# Altium schematic sheet Sheet1.SchDoc: FLOAT BOARD 2024
size B; DrawnBy: TOBY C.; Engineer: TOBY C.; Organization: CWRUBOTIX; Revision: 0; SheetNumber: 1; SheetTotal: 1; ENG_APP_DATE: --/--/--; DSN_APP_DATE: --/--/--; CHK_APP_DATE: --/--/--
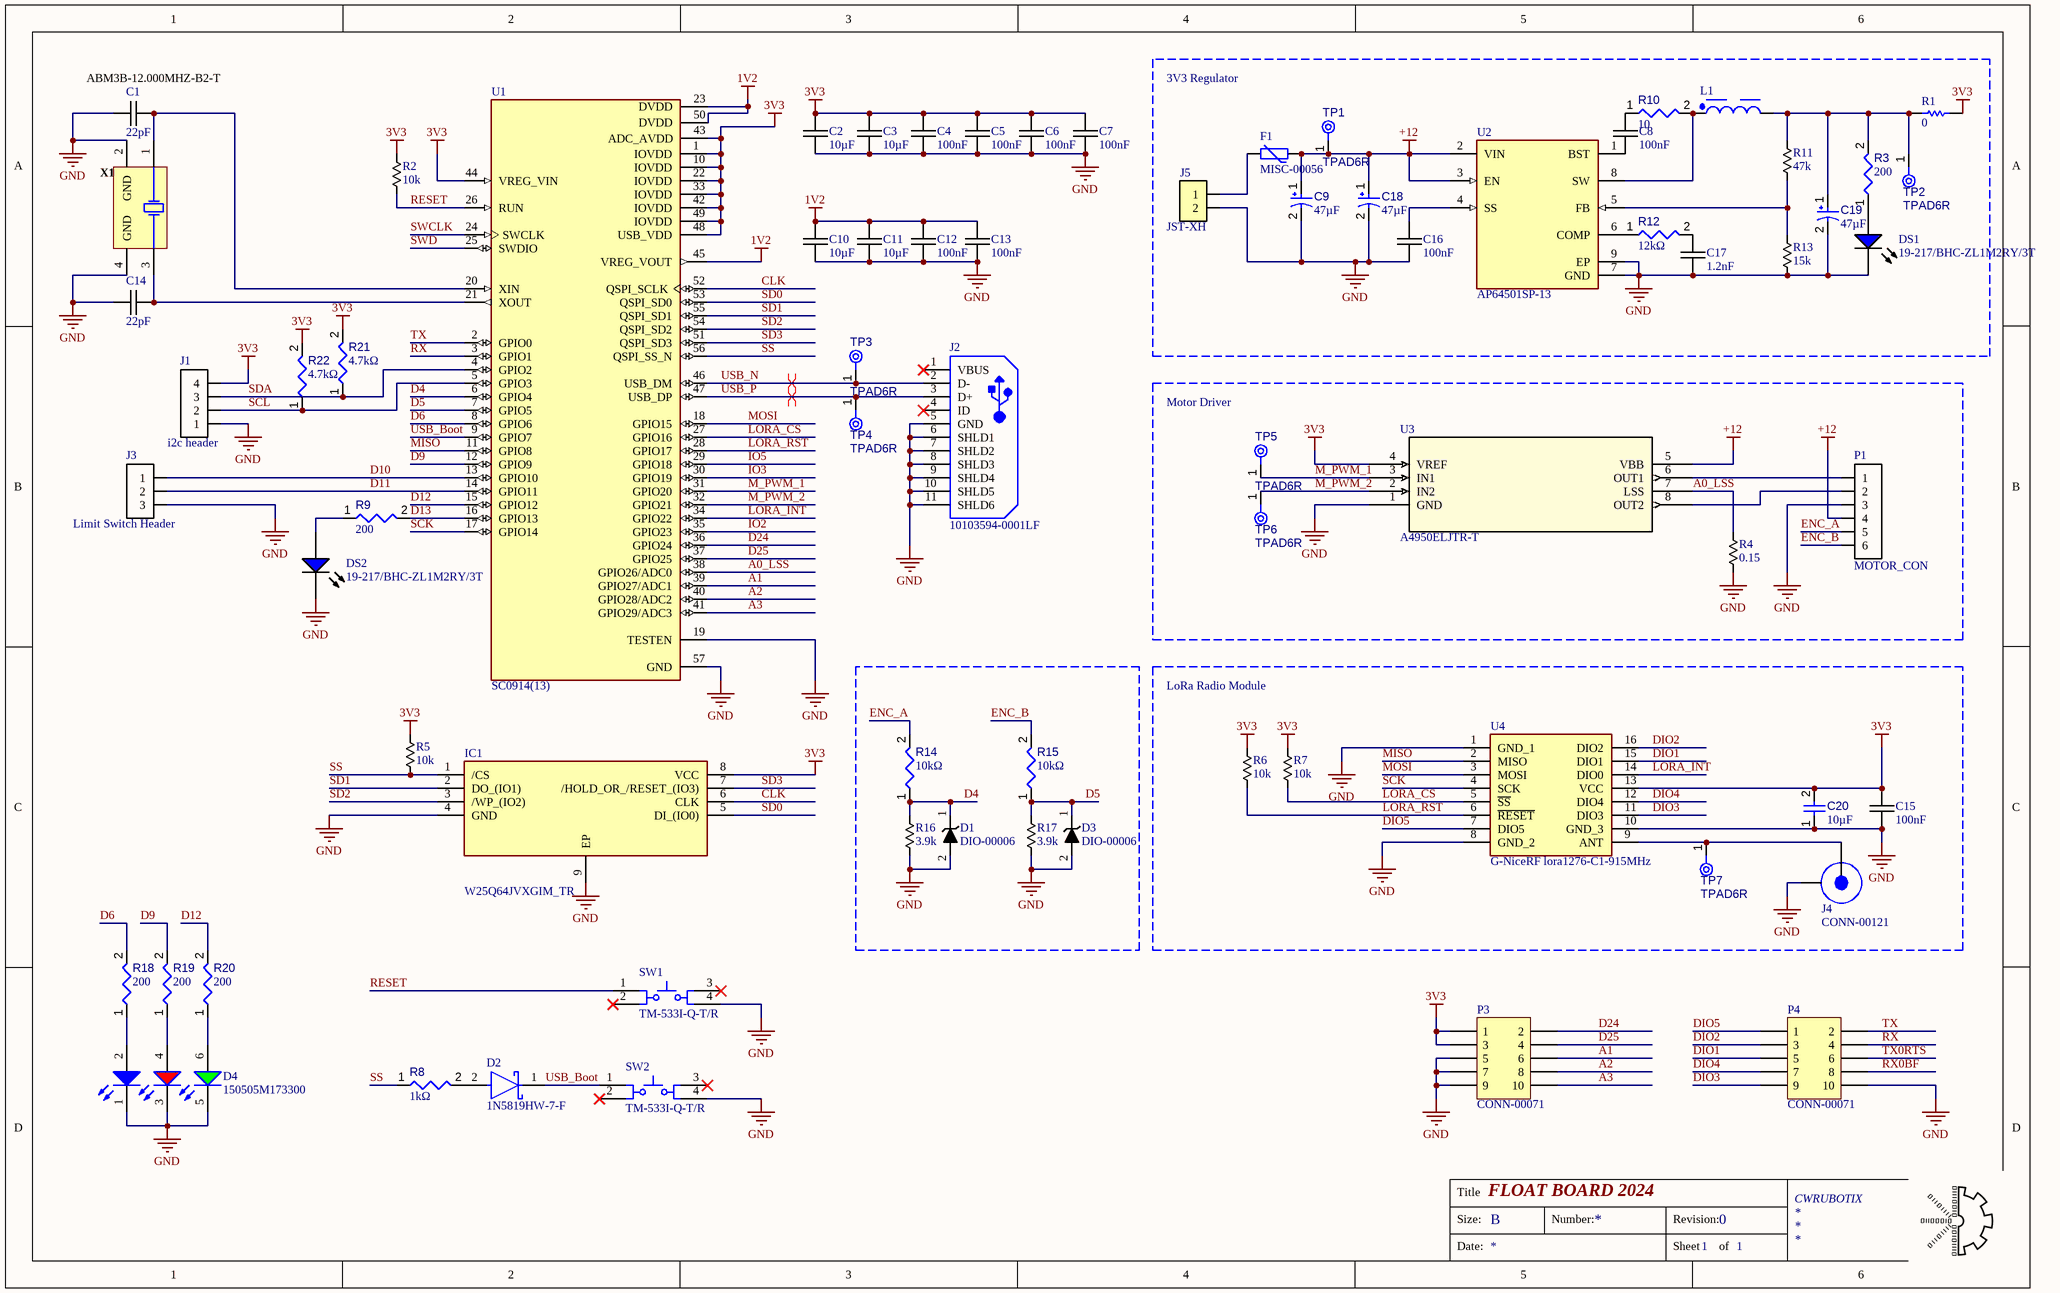
[diagram p0: Sheet1.SchDoc]

## Parts
C1  value 22pF  [chip_0603]  (hidden comment: CAP-00408)
C2  value 10µF  [chip_0805]  (hidden comment: CAP-00135)
C3  value 10µF  [chip_0805]  (hidden comment: CAP-00135)
C4  value 100nF  [chip_0603]  (hidden comment: CAP-00542)
C5  value 100nF  [chip_0603]  (hidden comment: CAP-00542)
C6  value 100nF  [chip_0603]  (hidden comment: CAP-00542)
C7  value 100nF  [chip_0603]  (hidden comment: CAP-00542)
C8  value 100nF  [chip_0603]  (hidden comment: CAP-00542)
C9  value 47µF  [AVX-TAJ-C-2_L]  (hidden comment: TAJC476K016RNJ)
C10  value 10µF  [chip_0805]  (hidden comment: CAP-00135)
C11  value 10µF  [chip_0805]  (hidden comment: CAP-00135)
C12  value 100nF  [chip_0603]  (hidden comment: CAP-00542)
C13  value 100nF  [chip_0603]  (hidden comment: CAP-00542)
C14  value 22pF  [chip_0603]  (hidden comment: CAP-00408)
C15  value 100nF  [chip_0603]  (hidden comment: CAP-00542)
C16  value 100nF  [chip_0603]  (hidden comment: CAP-00542)
C17  value 1.2nF  [chip_0603]  (hidden comment: CAP-00470)
C18  value 47µF  [AVX-TAJ-C-2_L]  (hidden comment: TAJC476K016RNJ)
C19  value 47µF  [AVX-TAJ-C-2_L]  (hidden comment: TAJC476K016RNJ)
C20  value 10µF  [CAPC0603(1608)100_L]  (hidden comment: Capacitor 10µF +/-20% 10V 0603)
D1  DIO-00006  [sod323_0]
D2  1N5819HW-7-F  [FP-SOD123-IPC_B]
D3  DIO-00006  [sod323_0]
D4  150505M173300  [WL-SFTW_5050_150505M173300]
DS1  19-217/BHC-ZL1M2RY/3T  [EVRL-0603-2_V]
DS2  19-217/BHC-ZL1M2RY/3T  [EVRL-0603-2_V]
F1  MISC-00056  [chip_1210]
IC1  W25Q64JVXGIM_TR  [SON80P400X400X50-9N]
J1  i2c header  [JST_XH_4_0]
J2  10103594-0001LF  [FCI-10103594-0001LF_V]
J3  Limit Switch Header  [JST_XH_3_0]
J4  CONN-00121  [SAMTEC_SMA-J-P-H-ST-EM1]
J5  JST-XH  [HDDR_2x1_0]
L1  7440430012  [WE-TPC_4828]  (value not drawn)
P1  MOTOR_CON  [HDDR_6X1_0]
P3  CONN-00071  [SAMTEC_SMD_HDDR_5x2]
P4  CONN-00071  [SAMTEC_SMD_HDDR_5x2]
R1  value 0  [RESC1608X55X25ML10T15]  (hidden comment: Resistor 0R +/- 5% 0603 100 mW)
R2  value 10k  [chip_0603]  (hidden comment: RES-00306)
R3  value 200  [RESC0402(1005)_L]  (hidden comment: Resistor 200R +/-5 % 0402 63 mW)
R4  value 0.15  [chip_0603]  (hidden comment: RES-00074)
R5  value 10k  [chip_0603]  (hidden comment: RES-00306)
R6  value 10k  [chip_0603]  (hidden comment: RES-00306)
R7  value 10k  [chip_0603]  (hidden comment: RES-00306)
R8  value 1kΩ  [RESC0402(1005)_L]  (hidden comment: 1KR2J)
R9  value 200  [RESC0402(1005)_L]  (hidden comment: Resistor 200R +/-5 % 0402 63 mW)
R10  value 10  [RESC0402(1005)_L]  (hidden comment: Resistor 10R  +/-1 % 0402 63 mW)
R11  value 47k  [chip_0603]  (hidden comment: RES-00799)
R12  value 12kΩ  [RESC0402(1005)_L]  (hidden comment: 12KR2F)
R13  value 15k  [chip_0603]  (hidden comment: RES-00341)
R14  value 10kΩ  [RESC0402(1005)_L]  (hidden comment: 10KR2F)
R15  value 10kΩ  [RESC0402(1005)_L]  (hidden comment: 10KR2F)
R16  value 3.9k  [chip_0603]  (hidden comment: RES-00782)
R17  value 3.9k  [chip_0603]  (hidden comment: RES-00782)
R18  value 200  [RESC0402(1005)_L]  (hidden comment: Resistor 200R +/-5 % 0402 63 mW)
R19  value 200  [RESC0402(1005)_L]  (hidden comment: Resistor 200R +/-5 % 0402 63 mW)
R20  value 200  [RESC0402(1005)_L]  (hidden comment: Resistor 200R +/-5 % 0402 63 mW)
R21  value 4.7kΩ  [RESC0402(1005)_L]  (hidden comment: 4D7KR2F)
R22  value 4.7kΩ  [RESC0402(1005)_L]  (hidden comment: 4D7KR2F)
SW1  TM-533I-Q-T/R  [MULT-TM-533I-Q_V]
SW2  TM-533I-Q-T/R  [MULT-TM-533I-Q_V]
TP1  TPAD6R  [TP06R]  (no BOM)
TP2  TPAD6R  [TP06R]  (no BOM)
TP3  TPAD6R  [TP06R]  (no BOM)
TP4  TPAD6R  [TP06R]  (no BOM)
TP5  TPAD6R  [TP06R]  (no BOM)
TP6  TPAD6R  [TP06R]  (no BOM)
TP7  TPAD6R  [TP06R]  (no BOM)
U1  SC0914(13)  [QFN40P700X700X90-57N]
U2  AP64501SP-13  [FP-SO-8EP-IPC_B]
U3  A4950ELJTR-T  [DDA0008H_L]
U4  G-NiceRF lora1276-C1-915MHz  [New footprint 1]
X1  ABM3B-12.000MHZ-B2-T  [ABRA-ABM3B-4_V]

## Blocks framed on the sheet
3V3 Regulator: C8 C9 C16-C19 DS1 F1 J5 L1 R1 R3 R10-R13 TP1 TP2 U2
Motor Driver: P1 R4 TP5 TP6 U3
LoRa Radio Module: C15 C20 J4 R6 R7 TP7 U4

## Nets
1V2: C10.1 C11.1 C12.1 C13.1 U1.23(DVDD) U1.45(VREG_VOUT) U1.50(DVDD)
3V3: C2.1 C3.1 C4.1 C5.1 C6.1 C7.1 C15.1 C20.2 IC1.8(VCC) J1.4 P3.1 P3.3 R1.2 R2.1 R5.1 R6.1 R7.1 R21.2 R22.2 U1.1(IOVDD) U1.10(IOVDD) U1.22(IOVDD) U1.33(IOVDD) U1.42(IOVDD) U1.43(ADC_AVDD) U1.44(VREG_VIN) U1.48(USB_VDD) U1.49(IOVDD) U3.4(VREF) U4.13(VCC)
+12: C9.1 C18.1 F1.1 P1.4 TP1.1(TP) U2.2(VIN) U2.3(EN) U3.5(VBB)
GND: C1.2 C2.2 C3.2 C4.2 C5.2 C6.2 C7.2 C9.2 C10.2 C11.2 C12.2 C13.2 C14.1 C15.2 C16.2 C17.2 C18.2 C19.2 C20.1 D1.2 D3.2 D4.1(K) D4.3(K) D4.5(K) DS1.2(K) DS2.2(K) IC1.4(GND) IC1.9(EP) J1.1 J2.5(GND) J2.6(SHLD1) J2.7(SHLD2) J2.8(SHLD3) J2.9(SHLD4) J2.10(SHLD5) J2.11(SHLD6) J3.3 J4.2 J5.2 P1.3 P3.5 P3.7 P3.9 P4.10 R4.2 R13.2 R16.2 R17.2 SW1.4 SW2.4 U1.19(TESTEN) U1.57(GND) U2.7(GND) U2.9(EP) U3.1(GND) U4.1(GND_1) U4.8(GND_2) U4.10(GND_3) X1.2(GND) X1.4(GND)
A0_LSS: R4.1 U1.38(GPIO26/ADC0) U3.7(LSS)
A1: P3.6 U1.39(GPIO27/ADC1)
A2: P3.8 U1.40(GPIO28/ADC2)
A3: P3.10 U1.41(GPIO29/ADC3)
CLK: IC1.6(CLK) U1.52(QSPI_SCLK)
D4: D1.1 R14.1 R16.1 U1.6(GPIO4)
D5: D3.1 R15.1 R17.1 U1.7(GPIO5)
D6: R18.2 U1.8(GPIO6)
D9: R19.2 U1.12(GPIO9)
D10: J3.1 U1.13(GPIO10)
D11: J3.2 U1.14(GPIO11)
D12: R20.2 U1.15(GPIO12)
D13: R9.2 U1.16(GPIO13)
D24: P3.2 U1.36(GPIO24)
D25: P3.4 U1.37(GPIO25)
DIO1: P4.5 U4.15(DIO1)
DIO2: P4.3 U4.16(DIO2)
DIO3: P4.9 U4.11(DIO3)
DIO4: P4.7 U4.12(DIO4)
DIO5: P4.1 U4.7(DIO5)
ENC_A: P1.5 R14.2
ENC_B: P1.6 R15.2
IO2: U1.35(GPIO23)
IO3: U1.30(GPIO19)
IO5: U1.29(GPIO18)
LORA_CS: R7.2 U1.27(GPIO16) U4.5(~{SS})
LORA_INT: U1.34(GPIO22) U4.14(DIO0)
LORA_RST: R6.2 U1.28(GPIO17) U4.6(~{RESET})
M_PWM_1: TP5.1(TP) U1.31(GPIO20) U3.3(IN1)
M_PWM_2: TP6.1(TP) U1.32(GPIO21) U3.2(IN2)
MISO: U1.11(GPIO8) U4.2(MISO)
MOSI: U1.18(GPIO15) U4.3(MOSI)
RESET: R2.2 SW1.1 U1.26(RUN)
RX: P4.4 U1.3(GPIO1)
RX0BF: P4.8
SCK: U1.17(GPIO14) U4.4(SCK)
SCL: J1.2 R22.1 U1.5(GPIO3)
SD0: IC1.5(DI_(IO0)) U1.53(QSPI_SD0)
SD1: IC1.2(DO_(IO1)) U1.55(QSPI_SD1)
SD2: IC1.3(/WP_(IO2)) U1.54(QSPI_SD2)
SD3: IC1.7(/HOLD_OR_/RESET_(IO3)) U1.51(QSPI_SD3)
SDA: J1.3 R21.1 U1.4(GPIO2)
SS: IC1.1(/CS) R5.2 R8.1 U1.56(QSPI_SS_N)
SWCLK: U1.24(SWCLK)
SWD: U1.25(SWDIO)
TX: P4.2 U1.2(GPIO0)
TX0RTS: P4.6
USB_Boot: D2.1(C) SW2.1 U1.9(GPIO7)
USB_N: J2.2(D-) TP3.1(TP) U1.46(USB_DM)
USB_P: J2.3(D+) TP4.1(TP) U1.47(USB_DP)
NetC1_1: C1.1 U1.20(XIN) X1.1(X1)
NetC8_1: C8.1 R10.1
NetC8_2: C8.2 U2.1(BST)
NetC14_2: C14.2 U1.21(XOUT) X1.3(X2)
NetC16_1: C16.1 U2.4(SS)
NetC17_1: C17.1 R12.2
NetC19_1: C19.1 L1.2 R1.1 R3.2 R11.1 TP2.1(TP)
NetD2_2: D2.2(A) R8.2
NetD4_2: D4.2(A) R18.1
NetD4_4: D4.4(A) R19.1
NetD4_6: D4.6(A) R20.1
NetDS1_1: DS1.1(A) R3.1
NetDS2_1: DS2.1(A) R9.1
NetF1_2: F1.2 J5.1
NetJ4_1: J4.1 TP7.1(TP) U4.9(ANT)
NetL1_1: L1.1 R10.2 U2.8(SW)
NetP1_1: P1.1 U3.6(OUT1)
NetP1_2: P1.2 U3.8(OUT2)
NetR11_2: R11.2 R13.1 U2.5(FB)
NetR12_1: R12.1 U2.6(COMP)

Not connected (* = marked no-connect by the designer): J2 1(VBUS)* 4(ID)*; SW1 2* 3*; SW2 2* 3*

## Layout directives
differential pair: USB_N, USB_P

## Notes on the sheet
- Title
- Size:
- B
- Number:
- Revision:
- Date:
- Sheet
- of

## Library data of the parts
C1 C14 = CMP-001-00458-1: CAP, 22pF, ±2%, 50V, C0G, 0603; Manufacturer: Murata; Manufacturer PN: GRM1885C1H220GA01D; Type: C0G; Tolerance: 2%; Part Number: CAP-00408; Voltage Rating: 50V
C2 C3 C10 C11 = CMP-001-00218-1: CAP, 10uF, 10%, 6.3V, X7R, 0805; Manufacturer: Murata; Manufacturer PN: GRM21BR70J106KE76K; Type: X7R; Part Number: CAP-00135; Voltage Rating: 6.3V; Tolerance: 10%
C4-C8 C12 C13 C15 C16 = CMP-001-00592-1: CAP, 0.1uF, ±10%, 16V, X7R, 0603; Manufacturer: Murata; Voltage Rating: 16V; Tolerance: 10%; Part Number: CAP-00542; Type: X7R
C9 C18 C19 = CMP-001-00047-6: Standard Tantalum, 47 uF, +/- 10%, 16 V, -55 to 125 degC, 2312 (6032 Metric), RoHS, Tape and Reel; Manufacturer: AVX; Resistance: 0.5Ohm; Voltage Rating: 16V; ESR: 500mohm; Tolerance: 10%; Case/Package: 2312; Capacitor Type: Tantalum; Datasheet URL: http://datasheets.avx.com/TAJ.pdf; Packaging: TapeandReel; Max Operating Temperature: 125°C; Manufacturer URL: http://www.avx.com/; Pins: 2; Package Quantity: 500; Datasheet Version: Feb-16; Min Operating Temperature: -55°C; Package Description: 2-Pin Surface Mount Device, Body 6 x 3.25 mm; Mounting Technology: SM; Package Reference: TAJ-C-2; RoHS Compliant: True
C17 = CMP-001-00520-1: CAP, 1200pF, ±1%, 50V, C0G, 0603; Manufacturer PN: GRM1885C1H122FA01D; Manufacturer: Murata; Tolerance: 1%; Part Number: CAP-00470; Type: C0G; Voltage Rating: 50V
C20 = CMP-001-00075-3: Chip Capacitor, 10µF +/-20%, 10V, 0603, Thickness 1 mm; Tolerance: 10%; Voltage Rating: 10V; Mounting Technology: SMT; Max Operating Temperature: 85°C; Min Operating Temperature: -55°C; Pins: 2; Case/Package: 0603
D1 D3 = CMP-004-00037-1: Dio Zen, 3.9V, 2%, 300mW, SOD-323; Manufacturer PN: MM3Z3V9ST1G; Manufacturer: ON Semi; Type: Zener; Forward Voltage: 900mV; Part Number: DIO-00006; Power Rating: 300mW; Reverse Breakdown Voltage: 3.9V; Tolerance: 2%
D2 = CMP-004-00132-1: Rectifier Diode, Schottky, 1 Phase, 1 Element, 1A, 40V V(RRM), Silicon; Forward Voltage: 320mV; Min Operating Temperature: -65°C; Max Operating Temperature: 125°C; RoHS Compliant: Yes; Pins: 2
D4 = CMP-03913-90235585-1: 150505M173300 WL-SFTW SMT full-color TOP LED waterclear; Max Reverse Voltage (DC): 5V; Forward Current: 80mA; Max Junction Temperature (Tj): 115°C; Peak Wavelength: 465nm; Color: Blue, Green, Red; Viewing Angle: 120°; Luminous Intensity: 350mcd; Dominant Wavelength: 520nm; Forward Voltage: 2V; Power Dissipation: 72mW; Length: 5.4mm; Width: 5mm; Min Operating Temperature: -40°C; Height: 1.5mm; Packaging: Tape and Reel; Max Operating Temperature: 85°C; RoHS: Compliant; Reverse Voltage: 5V; NexarPartId: 90235585
DS1 DS2 = CMP-007-00003-1: Chip LED, Blue, 5 V, 25 mA, -40 to 85 degC, 2-Pin SMD (0603), RoHS, Tape and Reel; Manufacturer: Everlight Electronics; Luminous Intensity: 28.5mcd; Forward Voltage: 3V; Forward Current: 25mA; Viewing Angle: 120degrees; Lens Style: Diffused; Packaging: TapeandReel; Mounting Technology: SM; Manufacturer URL: http://www.everlight.com/; Colour: Blue; Max Operating Temperature: 85°C; Datasheet Version: Rev. 1.0, 03/2003; Package Description: 2-Pin Surface Mount Device, Body 1.6 x 0.8 mm; RoHS Compliant: True; Package Reference: 0603; Pins: 2; Min Operating Temperature: -40°C; Case/Package: 0603; Datasheet URL: https://datasheet.ciiva.com/26901/getdatasheetpartid-420616-26901324.pdf
F1 = CMP-005-00017-1: PTC Fuse (Polyfuse), 16V 1.5A Hold, 3A Trip, 300ms; Manufacturer PN: 1210L150/16WR; Manufacturer: Littelfuse; Cost: 1; Distributor Link: https://www.digikey.com/en/products/detail/littelfuse-inc/1210L150-16WR/3997172; Part Number: MISC-00056
IC1 = W25Q64JVXGIM_TR: Integrated Circuit; Manufacturer_Name: Winbond; Manufacturer_Part_Number: W25Q64JVXGIM TR; Datasheet Link: https://www.winbond.com/resource-files/w25q64jv_dtr%20revj%2003272018%20plus.pdf; Height: 0.5mm; Mouser Part Number: 454-W25Q64JVXGIMTR; Mouser Price/Stock: https://www.mouser.co.uk/ProductDetail/Winbond/W25Q64JVXGIM-TR?qs=qSfuJ%252Bfl%2Fd5DYf7S8uijYQ%3D%3D; Arrow Part Number: W25Q64JVXGIM TR; Arrow Price/Stock: https://www.arrow.com/en/products/w25q64jvxgim-tr/winbond-electronics?region=nac
J1 = CMP-019-000111-1: JST XH 4-Pos, 2.5mm Pitch, THT; Manufacturer PN: B4B-XH-A(LF)(SN); Part Number: CONN-00116; Levels: 1; Current: 3; Positions per level: 4; Component Type: Standard; Type: Thru-hole; Distributor Link: https://www.digikey.com/en/products/detail/jst-sales-america-inc/B4B-XH-A-LF-SN/1651047; Source: Connectors$.SchLib; Design Item ID: CONN-00116; Cost: 0.21; Pin Count: 4; Manufacturer: JST
J2 = CMP-002-00038-1: Micro USB 2.0 B Receptacle, 5 Position, Height 3.24 mm, -55 to 85 degC, RoHS, Tape and Reel; Manufacturer: FCI Electronics; Voltage Rating: 100V; Gender: Female; Current Rating: 1.8A; Min Operating Temperature: -55°C; Pins: 5; Contact Plating: Gold; Package Description: 5-Pin Surface Mount Device, Body 8.04 x 5.62 mm; RoHS Compliant: True; Lead Pitch: 0.65mm; Packaging: TapeandReel; Case/Package: FCI-10103594-0001LF; Manufacturer URL: http://portal.fciconnect.com/; Mounting Technology: SM; Datasheet Version: Rev. A, 06/2010; Connector Type: USB; Contact Material: Copper; Datasheet URL: http://portal.fciconnect.com/Comergent//fci/drawing/10103594.pdf; Max Operating Temperature: 85°C; Package Quantity: 1500; Package Reference: FCI-10103594-0001LF
J3 = CMP-019-000006-1: JST XH 3x1, TH; Part Number: CONN-00006; Manufacturer PN: B3B-XH-A; Positions per level: 3; Levels: 1; Type: Header; Component Type: Standard; Current: 3; Design Item ID: CONN-00006; Manufacturer: JST; Pin Count: 3; Source: Connectors$.SchLib
J4 = CMP-019-000116-1: SMA Jack Female, 50 Ohm, Edge Launch, 20GHz; Manufacturer PN: SMA-J-P-H-ST-EM1; Manufacturer: Samtec; Levels: 1; Pin Count: 2; Cost: 4.15; Part Number: CONN-00121; Type: Jack; Positions per level: 1; Source: Connectors$.SchLib; Component Type: Standard; Design Item ID: CONN-00121; Distributor Link: https://www.digikey.com/en/products/detail/samtec-inc/SMA-J-P-H-ST-EM1/2602450
J5 = CMP-019-000054-1: Header, 2x1, 0.1"; Manufacturer PN: TSW-102-07-F-S; Part Number: CONN-00055; Manufacturer: Samtec; Levels: 1; Positions per level: 2; Design Item ID: CONN-00055; Pin Count: 2; Cost: 0.2; Source: Connectors$.SchLib; Component Type: Standard; Type: Header
L1 = CMP-006-00170-1: General Purpose Inductor, 1.2uH, 30%, 1 Element, Ferrite-Core, SMD, 1919; Max Current Rating: 3.1A; Self Resonant Frequency: 150MHz; Max Operating Temperature: 115°C; Tolerance: 30%; Pins: 2; RoHS Compliant: Yes; Min Operating Temperature: -40°C
P1 = CMP-019-000007-1: Header 6x1, 0.1"; Part Number: CONN-00008; Positions per level: 6; Levels: 1; Component Type: Standard; Source: Connectors$.SchLib; Design Item ID: CONN-00008; Pin Count: 6
P3 P4 = CMP-019-000066-1: Header, 5x2, 0.1", SMD; Manufacturer: Samtec; Manufacturer PN: TSM-105-01-L-DV-P; Levels: 2; Positions per level: 5; Source: Connectors$.SchLib; Part Number: CONN-00071; Pin Count: 10; Design Item ID: CONN-00071; Component Type: Standard; Type: Header; Cost: 1.17
R1 = CMP-009-00006-4: Chip Resistor, 0 Ohm, 0.1 W, -55 to 155 degC, 0603 (1608 Metric); Power: 100mW; Voltage Rating: 50V; Pins: 2; Mounting Technology: SM; Case/Package: 0603; Max Operating Temperature: 155°C; RoHS Compliant: True; Min Operating Temperature: -55°C; Tolerance: 5%
R2 R5-R7 = CMP-009-00489-1: RES SMD 10K OHM 1% 1/4W 0603; Manufacturer PN: ERJ-PA3F1002V; Manufacturer: Panasonic; Power Rating: 0.25W; Tolerance: 1%; Cost: 0.144; Part Number: RES-00306
R3 R9 R18-R20 = CMP-009-00161-2: Chip Resistor, 200 Ohms, +/-5 %, 63 mW, -55 to 155 degC, 0402; Power: 63mW; Tolerance: 5%; Case/Package: 0402; Pins: 2; Min Operating Temperature: -55°C; Max Operating Temperature: 155°C
R4 = CMP-009-00257-1: RES, 0.15, 1%, 250mW, 0603; Manufacturer PN: UCR03EVPFLR150; Manufacturer: Rohm; Power Rating: 250mW; Tolerance: 1%; Part Number: RES-00074
R8 = CMP-009-00075-1: 1K 0.063W 5% 0402 (1005 Metric)  SMD; Power: 63mW; Pins: 2; Mounting Technology: SMT; Tolerance: 5%; Case/Package: 0402
R10 = CMP-009-00152-2: Chip Resistor, 10 Ohms, +/-1 %, 63 mW, -55 to 155 degC, 0402; Power: 63mW; Tolerance: 1%; Min Operating Temperature: -55°C; Pins: 2; Max Operating Temperature: 155°C; Case/Package: 0402
R11 = CMP-009-00981-1: RES SMD 47K OHM 1% 1/10W 0603; Manufacturer PN: CRCW060347K0FKEA; Manufacturer: Vishay Dale; Power Rating: 1/10W; Part Number: RES-00799; Cost: 0.1; Tolerance: 1%
R12 = CMP-009-00071-1: 12K 0.063W 1% 0402 (1005 Metric)  SMD; Power: 63mW; Case/Package: 0402; Tolerance: 1%; Mounting Technology: SMT; Pins: 2
R13 = CMP-009-00524-1: RES SMD 15K OHM 1% 1/4W 0603; Manufacturer PN: ERJ-PA3F1502V; Manufacturer: Panasonic; Power Rating: 0.25W; Tolerance: 1%; Part Number: RES-00341
R14 R15 = CMP-009-00066-1: 10K 0.063W 1% 0402 (1005 Metric)  SMD; Power: 63mW; Case/Package: 0402; Mounting Technology: SMT; Pins: 2; Tolerance: 1%
R16 R17 = CMP-009-00964-1: RES SMD 3.9K OHM 1% 1/10W 0603; Manufacturer: Vishay Dale; Manufacturer PN: CRCW06033K90FKEA; Part Number: RES-00782; Cost: 0.1; Tolerance: 1%; Power Rating: 1/10W
R21 R22 = CMP-009-00105-1: 4K7 0.063W 1% 0402 (1005 Metric)  SMD; Power: 63mW; Tolerance: 1%; Mounting Technology: SMT; Case/Package: 0402; Pins: 2
SW1 SW2 = CMP-011-00009-1: Tactile Switch, SPNO, -25 to 70 degC, 4-Pin SMD, RoHS, Tape and Reel; Manufacturer: Multicomp; Max Contact Resistance: 100mohm; Resistance: 0.1Ohm; Operating Force: 160gf; Max Operating Temperature: 70°C; Mounting Technology: SM; RoHS Compliant: True; Package Description: 4-Pin Surface Mount Device, Body 5.2 x 5.2 mm; Package Reference: TM-533I-Q-T/R; Datasheet URL: http://www.micropik.com/PDF/pul5x5.pdf; Datasheet Version: Rev. 1.1, 12/2011; Min Operating Temperature: -25°C; Case/Package: TM-533I-Q-T/R
TP1-TP7 = CMP-00028-00002-1: 0.6mm round; Pins: 1
U1 = CMP-031-00110-2: ARMÂ® CortexÂ®-M0+ - Microcontroller IC 32-Bit Dual-Core 133MHz External Program Memory 56-QFN (7x7); MF: Raspberry Pi; MP: SC0914(13); Pins: 57; SnapEDA_Link: https://www.snapeda.com/parts/SC0914(13)/Raspberry+Pi/view-part/?ref=snap; Check_prices: https://www.snapeda.com/parts/SC0914(13)/Raspberry+Pi/view-part/?ref=eda; Source: SC0914(13).SchLib; Component Type: Standard; Case/Package: VFQFN-56 Raspberry Pi; Value: *; Design Item ID: SC0914(13)
U2 = CMP-019-00054-1: Switching Regulator, Current-mode, 630kHz Switching Freq-Max, PDSO8
U3 = CMP-121-000003-1: No Description Available; Mfr_Name: Allegro Microsystems Inc.; Type: Type; Source: A4950ELJTR-T.SchLib; Design Item ID: A4950ELJTR-T; RefDes: RefDes
U4 = CMP-021-00007-1: Lora Radio; Frequency: 915MHz
X1 = CMP-003-00015-1: Ceramic SMD Crystal, 12 MHz, +/- 20 ppm, 18 pF, -20 to 70 degC, 4-Pin SMD, RoHS, Tape and Reel; Manufacturer: Abracon; Tolerance: 20ppm; ESR: 70; Resistance: 70Ohm; Frequency: 12MHz; Load Capacitance: 18pF; Case/Package: CSMD; Max Operating Temperature: 70°C; Datasheet URL: http://www.abracon.com/Resonators/abm3b.pdf; Pins: 4; RoHS Compliant: True; Package Quantity: 1000; Package Reference: ABM3B; Frequency Tolerance: 20ppm; Datasheet Version: Aug-15; Mounting Technology: SM; Packaging: TapeandReel; Manufacturer URL: http://www.abracon.com/; Min Operating Temperature: -20°C; Package Description: 4-Pin Surface Mount Device, Body 5 x 3.2 mm